# EAGLE design 502_outin_raspberrypi (EAGLE 9.6.2)
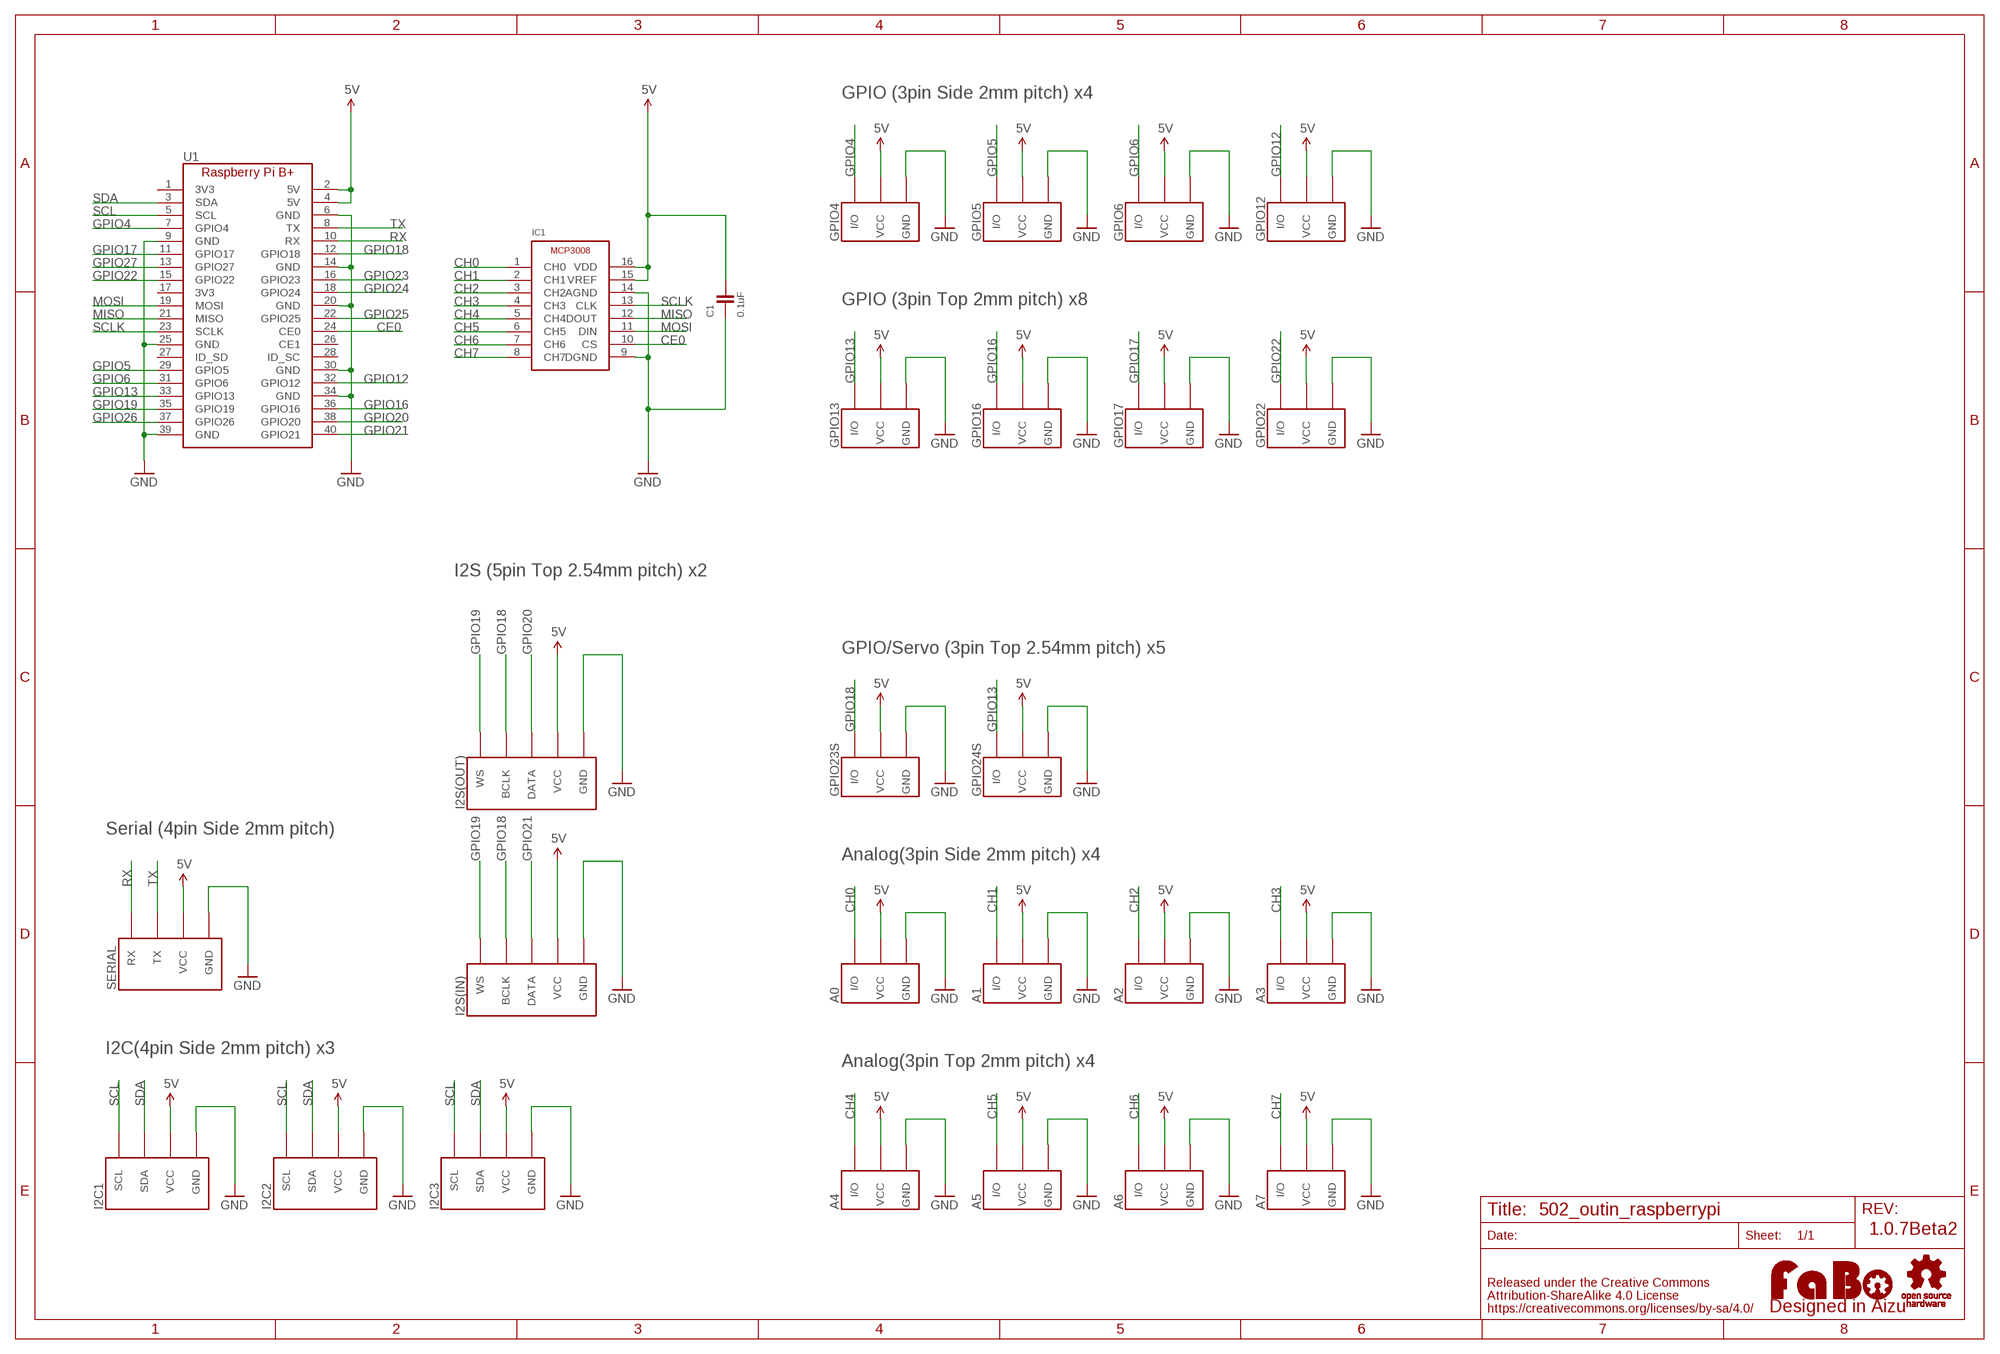
[diagram p0: schematic, sheet 1]

## Parts
A0  FABO_BRICK_3PIN-S03B-PASK-2  [FABO_BRICK_3PIN_S03B-PASK-2]
A1  FABO_BRICK_3PIN-S03B-PASK-2  [FABO_BRICK_3PIN_S03B-PASK-2]
A2  FABO_BRICK_3PIN-S03B-PASK-2  [FABO_BRICK_3PIN_S03B-PASK-2]
A3  FABO_BRICK_3PIN-S03B-PASK-2  [FABO_BRICK_3PIN_S03B-PASK-2]
A4  FABO_BRICK_3PIN-B03B-PASK-1  [FABO_BRICK_3PIN_B03B-PASK-1]
A5  FABO_BRICK_3PIN-B03B-PASK-1  [FABO_BRICK_3PIN_B03B-PASK-1]
A6  FABO_BRICK_3PIN-B03B-PASK-1  [FABO_BRICK_3PIN_B03B-PASK-1]
A7  FABO_BRICK_3PIN-B03B-PASK-1  [FABO_BRICK_3PIN_B03B-PASK-1]
C1  0.1uF  CAPACITOR-0603  [0603]
GPIO4  FABO_BRICK_3PIN-S03B-PASK-2  [FABO_BRICK_3PIN_S03B-PASK-2]
GPIO5  FABO_BRICK_3PIN-S03B-PASK-2  [FABO_BRICK_3PIN_S03B-PASK-2]
GPIO6  FABO_BRICK_3PIN-S03B-PASK-2  [FABO_BRICK_3PIN_S03B-PASK-2]
GPIO12  FABO_BRICK_3PIN-S03B-PASK-2  [FABO_BRICK_3PIN_S03B-PASK-2]
GPIO13  FABO_BRICK_3PIN-B03B-PASK-1  [FABO_BRICK_3PIN_B03B-PASK-1]
GPIO16  FABO_BRICK_3PIN-B03B-PASK-1  [FABO_BRICK_3PIN_B03B-PASK-1]
GPIO17  FABO_BRICK_3PIN-B03B-PASK-1  [FABO_BRICK_3PIN_B03B-PASK-1]
GPIO22  FABO_BRICK_3PIN-B03B-PASK-1  [FABO_BRICK_3PIN_B03B-PASK-1]
GPIO23S  FABO_BRICK_3PIN-HEADER  [FABO_BRICK_3PIN_HEADER]
GPIO24S  FABO_BRICK_3PIN-HEADER  [FABO_BRICK_3PIN_HEADER]
I2C1  FABO_BRICK_I2C-S04B-PASK-2  [FABO_BRICK_I2C_S04B-PASK-2]
I2C2  FABO_BRICK_I2C-S04B-PASK-2  [FABO_BRICK_I2C_S04B-PASK-2]
I2C3  FABO_BRICK_I2C-S04B-PASK-2  [FABO_BRICK_I2C_S04B-PASK-2]
I2S(IN)  FABO_BRICK_I2SLONG  [FABO_BRICK_I2S_S05B-PASK-2_LONG]
I2S(OUT)  FABO_BRICK_I2SLONG  [FABO_BRICK_I2S_S05B-PASK-2_LONG]
IC1  MICROCHIP-MCP3008  [MICROCHIP-MCP3008]
LOGO1  LOGO_FABO-M  [LOGO_FABO_M]
SERIAL  FABO_BRICK_SERIAL-S04B-PASK-2  [FABO_BRICK_SERIAL_S04B-PASK-2]
U1  RASPBERRY_PI_B+  [RASPBERRY_PI_B+]
U$4  LOGO_OSHW-T_M_BOTTOM  [LOGO_OSHW_T_MS_BOTTOM]

## Nets
5V: A0.VCC A1.VCC A2.VCC A3.VCC A4.VCC A5.VCC A6.VCC A7.VCC C1.2 GPIO4.VCC GPIO5.VCC GPIO6.VCC GPIO12.VCC GPIO13.VCC GPIO16.VCC GPIO17.VCC GPIO22.VCC GPIO23S.VCC GPIO24S.VCC I2C1.VCC I2C2.VCC I2C3.VCC I2S(IN).VCC I2S(OUT).VCC IC1.15(VREF) IC1.16(VDD) SERIAL.VCC U1.2(5V) U1.4(5V)
CE0: IC1.10(CS) U1.24(CE0)
CH0: A0.I/O IC1.1(CH0)
CH1: A1.I/O IC1.2(CH1)
CH2: A2.I/O IC1.3(CH2)
CH3: A3.I/O IC1.4(CH3)
CH4: A4.I/O IC1.5(CH4)
CH5: A5.I/O IC1.6(CH5)
CH6: A6.I/O IC1.7(CH6)
CH7: A7.I/O IC1.8(CH7)
GND: A0.GND A1.GND A2.GND A3.GND A4.GND A5.GND A6.GND A7.GND C1.1 GPIO4.GND GPIO5.GND GPIO6.GND GPIO12.GND GPIO13.GND GPIO16.GND GPIO17.GND GPIO22.GND GPIO23S.GND GPIO24S.GND I2C1.GND I2C2.GND I2C3.GND I2S(IN).GND I2S(OUT).GND IC1.9(DGND) IC1.14(AGND) SERIAL.GND U1.6(GND) U1.9(GND) U1.14(GND) U1.20(GND) U1.25(GND) U1.30(GND) U1.34(GND) U1.39(GND)
GPIO4: GPIO4.I/O U1.7(GPIO4)
GPIO5: GPIO5.I/O U1.29(GPIO5)
GPIO6: GPIO6.I/O U1.31(GPIO6)
GPIO12: GPIO12.I/O U1.32(GPIO12)
GPIO13: GPIO13.I/O GPIO24S.I/O U1.33(GPIO13)
GPIO16: GPIO16.I/O U1.36(GPIO16)
GPIO17: GPIO17.I/O U1.11(GPIO17)
GPIO18: GPIO23S.I/O I2S(IN).BCLK I2S(OUT).BCLK U1.12(GPIO18)
GPIO19: I2S(IN).WS I2S(OUT).WS U1.35(GPIO19)
GPIO20: I2S(OUT).DATA U1.38(GPIO20)
GPIO21: I2S(IN).DATA U1.40(GPIO21)
GPIO22: GPIO22.I/O U1.15(GPIO22)
GPIO23: U1.16(GPIO23)
GPIO24: U1.18(GPIO24)
GPIO25: U1.22(GPIO25)
GPIO26: U1.37(GPIO26)
GPIO27: U1.13(GPIO27)
MISO: IC1.12(DOUT) U1.21(MISO)
MOSI: IC1.11(DIN) U1.19(MOSI)
RX: SERIAL.RX U1.10(RX)
SCL: I2C1.SCL I2C2.SCL I2C3.SCL U1.5(SCL)
SCLK: IC1.13(CLK) U1.23(SCLK)
SDA: I2C1.SDA I2C2.SDA I2C3.SDA U1.3(SDA)
TX: SERIAL.TX U1.8(TX)
Unconnected: U1.1(3V3) U1.17(3V3) U1.26(CE1) U1.27(ID_SD) U1.28(ID_SC)

## Notes on the sheet
- GPIO (3pin Side 2mm pitch) x4
- GPIO (3pin Top 2mm pitch) x8
- I2S (5pin Top 2.54mm pitch) x2
- GPIO/Servo (3pin Top 2.54mm pitch) x5
- Serial (4pin Side 2mm pitch)
- Analog(3pin Side 2mm pitch) x4
- I2C(4pin Side 2mm pitch) x3
- Analog(3pin Top 2mm pitch) x4
- 1.0.7Beta2

## Library data of the parts
A0 A1-A7 GPIO4-GPIO6 GPIO12 GPIO13 GPIO16 GPIO17 GPIO22 GPIO23S GPIO24S = FaBo-Template:FABO_BRICK_3PIN: FaBo Brick 3pin
C1 = FaBo-Capacitor:CAPACITOR: CAPACITOR
I2C1-I2C3 = FaBo-Template:FABO_BRICK_I2C: FaBo Brick I2C
I2S(IN) I2S(OUT) = FaBo-Template:FABO_BRICK_I2S
IC1 = FaBo-ADC:MICROCHIP-MCP3008
LOGO1 = component:LOGO_FABO
SERIAL = FaBo-Template:FABO_BRICK_SERIAL: FaBo Brick Serial
U1 = FaBo-Boards:RASPBERRY_PI_B+
U$4 = FaBo-etc:LOGO_OSHW

## Board
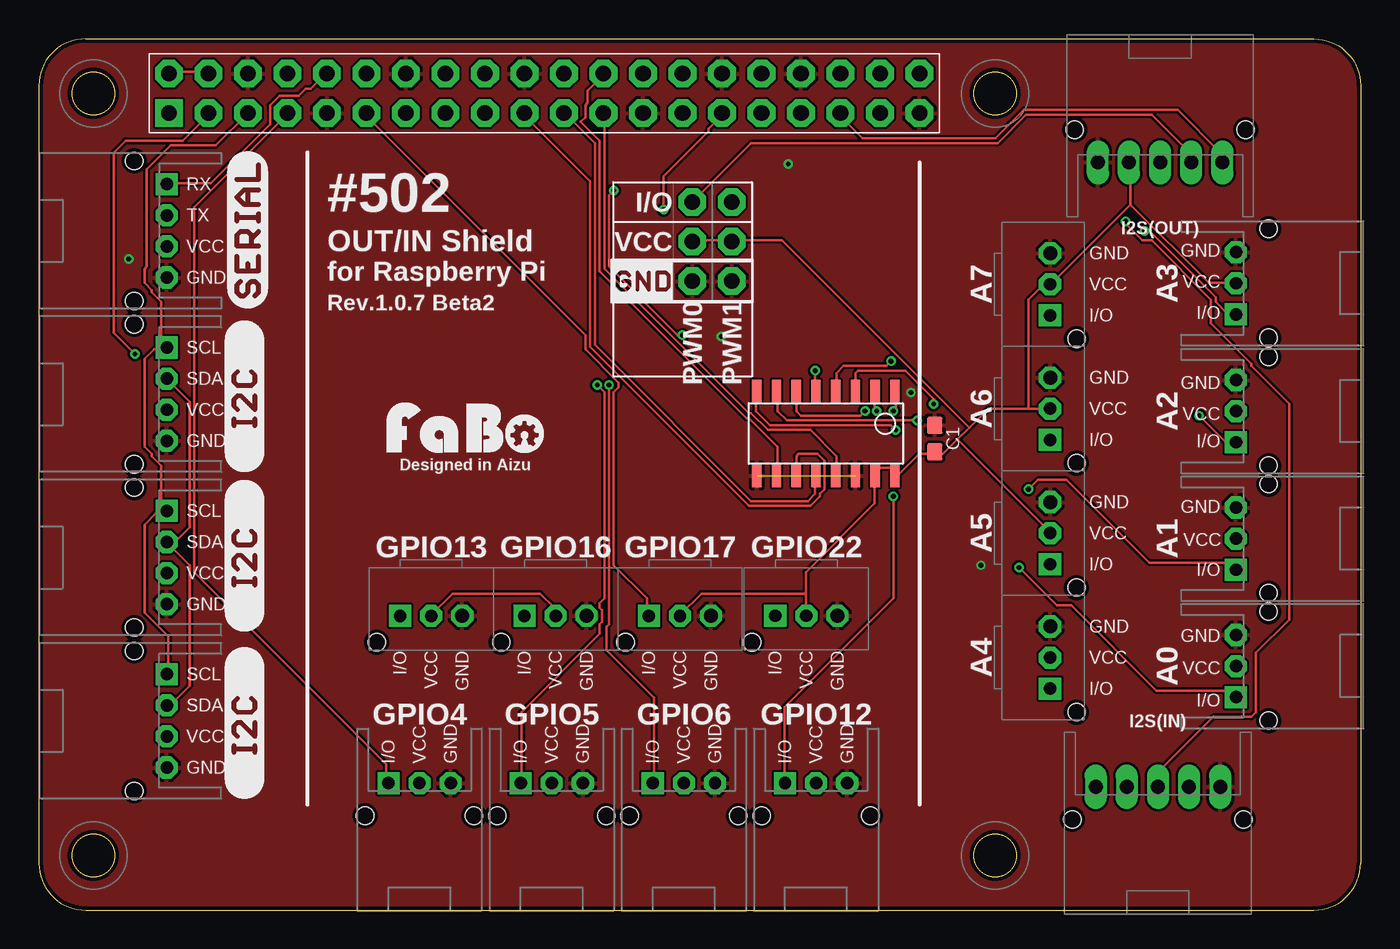
[diagram p1: board, top side]
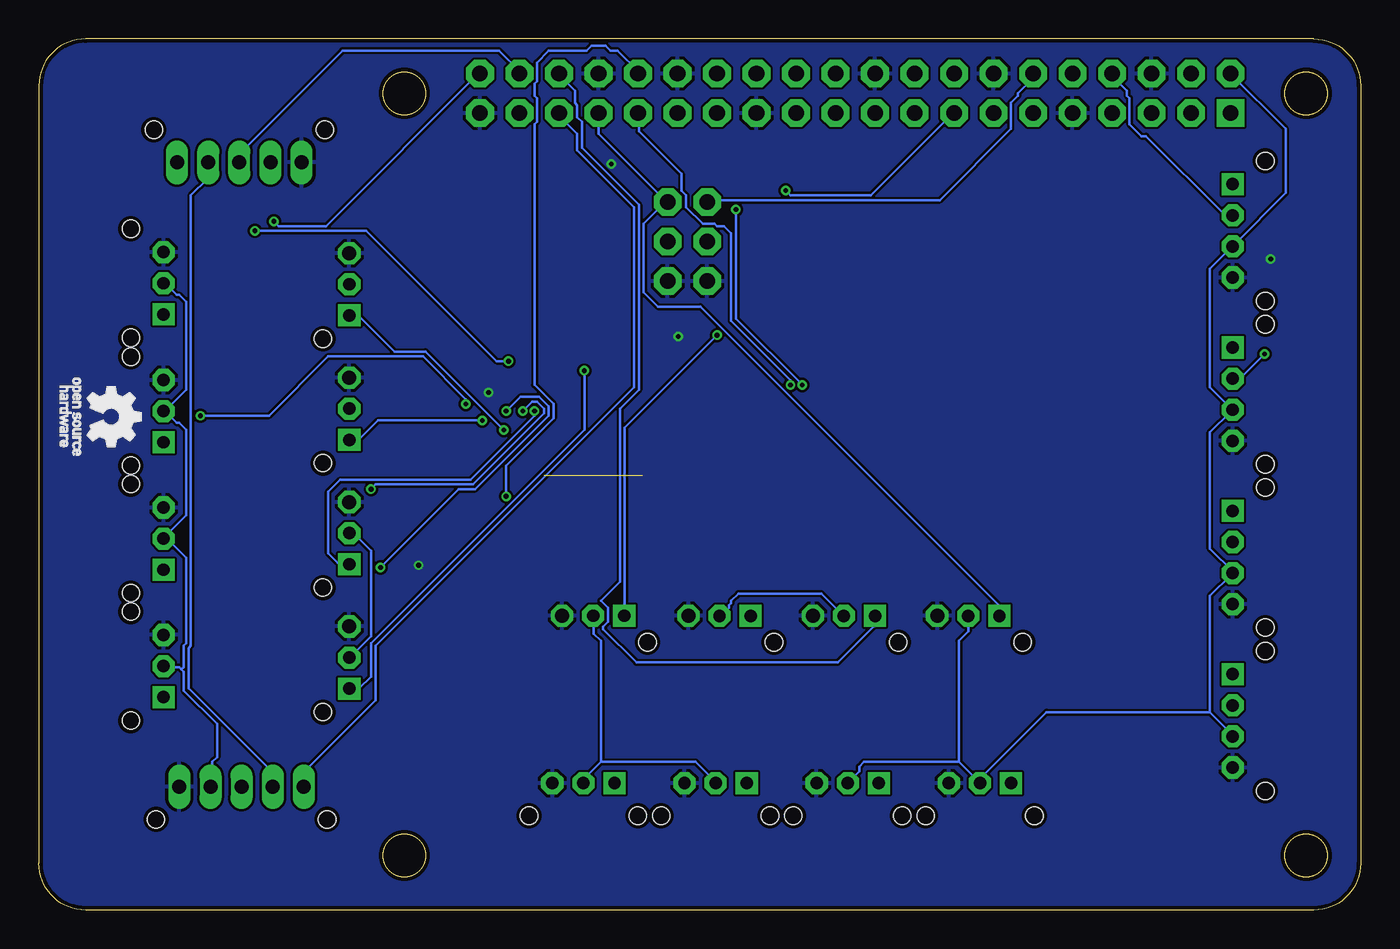
[diagram p2: board, bottom side, seen from below]

Size 85 x 56 mm. Coordinates in mm from the lower left corner, seen from the top.
Copper layers (1*16): Top 0.035mm / dielectric 1.6mm / Bottom 0.035mm
Design rules "PCBway": minimum track width 6mil, minimum drill 12mil, track to track 6mil, track to pad 6mil, pad to pad 6mil, via to via 6mil, smd to smd 6mil, copper to edge 10mil, drill to drill 10mil, minimum pad ring 10mil, minimum via ring 6mil, stop-mask expansion 2mil, vias tented up to drill 100mil, thermal gap 8mil

### Footprints (pad centres in the part's own frame; a part is rotated, then mirrored left to right if it is on the bottom)
FABO_BRICK_3PIN_S03B-PASK-2 = drill 0.8 pad 1.422 octagon: GND -2,0; VCC 0,0 | drill 0.8 pad 1.422 square: I/O 2,0 | hole 1.1: 3.5,2.1; -3.5,2.1
FABO_BRICK_3PIN_B03B-PASK-1 = drill 0.9 pad 1.422 octagon: GND -2,0 | drill 0.8 pad 1.422 square: I/O 2,0 | drill 0.8 pad 1.422 octagon: VCC 0,0 | hole 1.1: 3.5,1.7
0603 = smd 1.1 x 1: 1 -0.85,0; 2 0.85,0
FABO_BRICK_3PIN_HEADER = drill 1 pad 1.778 octagon: GND -2.54,0; I/O 2.54,0; VCC 0,0
FABO_BRICK_I2C_S04B-PASK-2 = drill 0.8 pad 1.422 octagon: GND -3,0; SDA 1,0; VCC -1,0 | drill 0.8 pad 1.422 square: SCL 3,0 | hole 1.1: 4.5,2.1; -4.5,2.1
FABO_BRICK_I2S_S05B-PASK-2_LONG = drill 0.9 pad 1.422 long: BCLK 3,0; DATA 1,0; GND -3,0; VCC -1,0; WS 5,0 | hole 1.1: 6.5,2.1; -4.5,2.1
MICROCHIP-MCP3008 = smd 0.6 x 1.5: 1 -4.445,-2.7; 2 -3.175,-2.7; 3 -1.905,-2.7; 4 -0.635,-2.7; 5 0.635,-2.7; 6 1.905,-2.7; 7 3.175,-2.7; 8 4.445,-2.7; 9 4.445,2.7; 10 3.175,2.7; 11 1.905,2.7; 12 0.635,2.7; 13 -0.635,2.7; 14 -1.905,2.7; 15 -3.175,2.7; 16 -4.445,2.7
FABO_BRICK_SERIAL_S04B-PASK-2 = drill 0.8 pad 1.422 octagon: GND -3,0; TX 1,0; VCC -1,0 | drill 0.8 pad 1.422 square: RX 3,0 | hole 1.1: 4.5,2.1; -4.5,2.1
RASPBERRY_PI_B+ = drill 1 pad 1.778 square: 1 0,-2.54 | drill 1 pad 1.778 octagon: 2 0,0; 3 2.54,-2.54; 4 2.54,0; 5 5.08,-2.54; 6 5.08,0; 7 7.62,-2.54; 8 7.62,0; 9 10.16,-2.54; 10 10.16,0; 11 12.7,-2.54; 12 12.7,0; 13 15.24,-2.54; 14 15.24,0; 15 17.78,-2.54; 16 17.78,0; 17 20.32,-2.54; 18 20.32,0; 19 22.86,-2.54; 20 22.86,0; 21 25.4,-2.54; 22 25.4,0; 23 27.94,-2.54; 24 27.94,0; 25 30.48,-2.54; 26 30.48,0; 27 33.02,-2.54; 28 33.02,0; 29 35.56,-2.54; 30 35.56,0; 31 38.1,-2.54; 32 38.1,0; 33 40.64,-2.54; 34 40.64,0; 35 43.18,-2.54; 36 43.18,0; 37 45.72,-2.54; 38 45.72,0; 39 48.26,-2.54; 40 48.26,0

### Placement (x,y rotation side)
A0  76.98,15.68 270 top
A1  76.98,23.88 270 top
A2  76.98,32.07 270 top
A3  76.98,40.29 270 top
A4  65.03,16.23 270 top
A5  65.03,24.23 270 top
A6  65.03,32.23 270 top
A7  65.03,40.23 270 top
C1  57.62,30.3 270 top
GPIO4  24.48,8.16 180 top
GPIO5  32.98,8.16 180 top
GPIO6  41.48,8.16 180 top
GPIO12  49.98,8.16 180 top
GPIO13  25.23,18.91 180 top
GPIO16  33.23,18.91 180 top
GPIO17  41.23,18.91 180 top
GPIO22  49.36,18.92 180 top
GPIO23S  42.02,42.98 90 top
GPIO24S  44.56,42.98 90 top
I2C1  8.23,33.16 90 top
I2C2  8.23,22.66 90 top
I2C3  8.23,12.16 90 top
I2S(IN)  72.96,7.92 180 top
I2S(OUT)  71.11,48.06 0 top
IC1  50.61,30.63 180 top
LOGO1  27.42,29.01 0 top
SERIAL  8.23,43.66 90 top
U1  8.37,53.77 0 top
U$2  [LOGO_SILK_I2C]  14.48,17.91 90 top
U$3  [LOGO_SILK_SERIAL2]  14.73,38.66 90 top
U$4  80.38,31.7 90 top
U$5  [LOGO_SILK_I2C]  14.48,7.16 90 top
U$6  [LOGO_SILK_I2C]  14.48,28.16 90 top
U$7  [LOGO_SILK_GND]  36.95,39.17 0 top

### Tracks (layer width: path | path; a pad name or v marks a point on that pad's centre or on a via)
5V
  Top 0.152: 70.19,45.34 65.16,40.31 A7.VCC 65.01,40.16 64.56,40.16 63.64,39.24 63.64,32.23 | 70.19,45.34 70.19,47.93 I2S(OUT).VCC | 70.19,45.34 75.22,40.31 76.9,40.31 A3.VCC | U1.2 8.47,53.87 10.91,53.87 U1.4 | GPIO13.VCC 25.24,18.97 26.61,20.34 32.25,20.34 33.16,19.43 33.16,18.97 GPIO16.VCC | GPIO23S.VCC 42.15,43.05 44.44,43.05 GPIO24S.VCC 44.59,43.05 47.79,43.05 59.83,31.01 | 55.11,28.12 55.26,27.96 56.63,29.34 57.54,29.34 C1.2 57.7,29.34 57.7,29.03 57.85,29.03 59.07,30.25 | 55.11,28.12 54.95,27.96 IC1.16 55.11,28.12 | 55.11,28.12 55.11,28.42 53.73,28.42 53.73,27.96 IC1.15 53.73,27.81 53.73,26.14 49.31,21.72 49.31,20.34 | 49.31,20.34 49.31,18.97 GPIO22.VCC | 63.64,32.23 61.05,32.23 59.83,31.01 | 63.64,32.23 65.01,32.23 A6.VCC | 59.07,30.25 59.83,31.01 | 59.07,30.25 65.01,24.31 A5.VCC | 49.31,20.34 42.61,20.34 41.24,18.97 GPIO17.VCC
  Bottom 0.152: 75.83,15.47 75.98,15.62 76.9,15.62 A0.VCC | 75.83,15.47 75.68,15.31 75.68,14.1 73.55,11.96 73.55,9.83 73.85,9.52 73.85,8 I2S(IN).VCC | 75.83,15.47 75.68,15.62 75.68,16.99 75.53,17.14 75.53,22.63 76.44,23.54 76.59,23.54 76.9,23.85 A1.VCC 76.9,24 75.53,25.37 75.53,30.86 75.98,31.32 76.14,31.32 76.9,32.08 | 76.9,32.08 75.53,33.45 75.53,39.09 75.98,39.55 76.14,39.55 76.9,40.31 A3.VCC | 76.9,32.08 A2.VCC | 9.69,12.72 8.62,11.66 8.62,11.5 8.32,11.2 I2C3.VCC | 9.69,12.72 9.69,20.19 8.32,21.56 I2C2.VCC 8.17,21.72 9.69,23.24 9.69,30.71 8.32,32.08 I2C1.VCC 8.32,32.23 9.69,33.6 9.69,41.22 8.32,42.59 SERIAL.VCC 8.17,42.75 4.81,46.1 4.81,50.21 U1.2 | 25.84,9.52 24.63,8.3 | 25.84,9.52 31.94,9.52 32.25,9.22 32.25,8.91 32.86,8.3 GPIO5.VCC | GPIO17.VCC 41.08,18.97 40.63,19.43 40.63,19.58 40.48,19.73 40.48,19.89 40.02,20.34 34.68,20.34 33.31,18.97 GPIO16.VCC | 25.84,9.52 25.84,17.3 25.24,17.91 25.24,18.82 GPIO13.VCC | 48.86,9.52 42.76,9.52 41.54,8.3 GPIO6.VCC | 48.86,9.52 50.08,8.3 GPIO12.VCC | A4.VCC 65.01,16.23 63.64,17.6 63.64,23.09 64.71,24.15 65.01,24.15 A5.VCC | 48.86,9.52 48.86,17.3 49.31,17.75 49.31,18.82 GPIO22.VCC | 9.69,12.72 20.21,12.72 24.63,8.3 | 24.63,8.3 GPIO4.VCC
CE0
  Top 0.152: IC1.10 47.49,27.96 47.49,29.79 45.66,31.62 45.5,31.62 36.06,41.07 36.06,49.45 34.84,50.67 35.14,50.98 35.14,51.74 35.29,51.89 35.29,52.65 36.36,53.72 U1.24
CH0  (via drill 0.3)
  Top 0.152: v54.95,32.08 55.11,32.23 55.11,33.3 IC1.1 | v63.03,22.02 65.47,19.58 66.38,19.58 71.87,14.1 76.59,14.1 76.9,13.79 A0.I/O
  Bottom 0.152: v54.95,32.08 54.04,32.99 52.82,32.99 52.21,32.38 52.21,31.77 56.93,27.05 58,27.05 v63.03,22.02
CH1  (via drill 0.3)
  Top 0.152: v53.89,32.08 53.73,32.23 53.73,33.3 IC1.2 | v63.64,27.05 64.25,27.66 66.08,27.66 71.41,22.33 76.59,22.33 76.9,22.02 A1.I/O
  Bottom 0.152: v53.89,32.08 53.28,32.69 52.97,32.69 52.51,32.23 52.51,31.93 57.09,27.35 63.34,27.35 v63.64,27.05
CH2  (via drill 0.3)
  Top 0.152: IC1.3 52.51,34.52 52.67,34.67 55.72,34.67 57.54,32.84 v57.54,32.54 | v74.61,31.77 76.29,30.1 76.9,30.1 A2.I/O
  Bottom 0.152: v57.54,32.54 57.54,32.84 60.29,35.58 66.38,35.58 70.19,31.77 v74.61,31.77
CH3  (via drill 0.3)
  Top 0.152: v54.8,35.28 54.5,34.97 51.75,34.97 51.3,34.52 51.3,33.45 IC1.4 | v71.11,43.66 71.41,43.66 75.68,39.39 75.68,39.09 76.44,38.33 76.9,38.33 A3.I/O
  Bottom 0.152: v54.8,35.28 55.56,35.28 63.95,43.66 v71.11,43.66
CH4  (via drill 0.3)
  Top 0.152: v49.92,34.67 49.92,33.45 IC1.5
  Bottom 0.152: v49.92,34.67 49.92,30.86 63.64,17.14 63.64,15.01 64.4,14.25 65.01,14.25 A4.I/O
CH5  (via drill 0.3)
  Top 0.152: IC1.6 48.7,32.08 49.01,31.77 52.82,31.77 v53.12,32.08
  Bottom 0.152: v53.12,32.08 53.12,31.77 57.24,27.66 65.62,27.66 66.38,26.9 66.38,22.93 65.77,22.33 65.16,22.33 A5.I/O
CH6  (via drill 0.3)
  Top 0.152: v56.48,31.47 48.1,31.47 47.49,32.08 47.49,33.3 IC1.7
  Bottom 0.152: v56.48,31.47 63.18,31.47 64.4,30.25 65.01,30.25 A6.I/O
CH7  (via drill 0.3)
  Top 0.152: v55.11,30.86 54.8,31.16 47.03,31.16 46.11,32.08 46.11,33.3 IC1.8
  Bottom 0.152: v55.11,30.86 60.13,35.89 62.12,35.89 64.4,38.17 65.01,38.17 A7.I/O
GND  (via drill 0.3)  (1 unrouted)
  other vias: 5.78,41.86 60.58,22.16 43.88,36.86 56.08,33.26 48.18,47.96
  pour Bottom: -0.52,-0.84 85.48,-0.84 85.48,56.16 -0.52,56.16
  pour Top: -0.52,-0.84 85.48,-0.84 85.48,56.16 -0.52,56.16
GPIO4
  Top 0.152: GPIO4.I/O 22.34,8.3 22.34,9.37 10,21.72 10,45.19 15.94,51.13 U1.7
GPIO5  (via drill 0.3)
  Top 0.152: v35.9,33.76 36.36,33.3 36.36,20.04 36.06,19.73 36.06,19.43 36.21,19.28 36.21,18.52 36.06,18.36 36.06,17.75 31.03,12.72 31.03,8.3 GPIO5.I/O | v40.17,45.03 40.17,47.17 43.07,50.06 43.07,50.21 43.98,51.13 U1.29
  Bottom 0.152: v35.9,33.76 40.17,38.02 v40.17,45.03
GPIO6  (via drill 0.3)
  Top 0.152: v36.67,33.76 36.67,18.36 36.51,18.21 36.51,16.69 39.56,13.64 39.56,8.3 GPIO6.I/O
  Bottom 0.152: v36.67,33.76 36.67,34.06 40.48,37.87 40.48,43.51 40.93,43.97 41.39,43.97 41.54,44.12 42.3,44.12 43.37,45.19 43.37,45.95 43.68,46.25 43.68,47.32 46.42,50.06 46.42,51.13 U1.31
GPIO12  (via drill 0.3)
  Top 0.152: v54.95,26.59 54.95,20.04 47.94,13.03 47.94,8.3 GPIO12.I/O
  Bottom 0.152: v54.95,26.59 54.95,28.57 51.91,31.62 51.91,32.54 53.12,33.76 53.12,50.52 52.97,50.67 52.97,52.2 53.12,52.35 53.12,53.11 52.97,53.26 52.97,54.48 52.21,55.24 49.77,55.24 49.47,55.55 48.55,55.55 48.25,55.24 47.79,55.24 46.42,53.87 U1.32
GPIO13
  Bottom 0.152: GPIO13.I/O 23.25,18.97 23.25,19.58 42.46,38.78 45.2,38.78 46.11,39.7 46.11,44.12 44.59,45.64 GPIO24S.I/O 44.59,45.49 49.01,49.91 U1.33
GPIO16
  Bottom 0.152: GPIO16.I/O 31.33,18.82 31.33,18.21 33.62,15.92 46.57,15.92 48.7,18.06 48.7,18.21 48.4,18.52 48.4,19.43 48.86,19.89 47.64,21.11 47.64,32.23 46.42,33.45 46.42,45.34 50.08,49 50.08,50.67 50.38,50.98 50.38,51.74 50.53,51.89 50.53,52.65 51.6,53.72 U1.36
GPIO17
  Top 0.152: GPIO17.I/O 39.1,18.97 39.1,20.04 36.97,22.17 36.97,33.3 37.27,33.6 37.27,33.91 35.14,36.04 35.14,36.96 20.97,51.13 U1.11
GPIO18
  Top 0.152: GPIO23S.I/O 45.81,49.3 61.66,49.3 63.49,51.13 71.56,51.13 74,48.69 74,48.08 I2S(OUT).BCLK
  Bottom 0.152: U1.12 21.12,53.72 21.12,53.41 22.03,52.5 22.03,52.35 22.49,51.89 22.49,50.21 27.06,45.64 42,45.64 GPIO23S.I/O | I2S(IN).BCLK 70.04,8 70.04,8.91 75.38,14.25 75.38,16.84 75.22,16.99 75.22,45.95 74.16,47.01 74.16,47.93 I2S(OUT).BCLK
GPIO19
  Top 0.152: I2S(OUT).WS 75.98,48.08 75.98,48.69 73.24,51.43 63.34,51.43 61.51,49.6 52.97,49.6 51.45,51.13 U1.35
  Bottom 0.152: I2S(IN).WS 67.91,8 67.91,8.91 63.34,13.49 63.34,16.99 46.72,33.6 46.72,45.19 50.38,48.84 50.38,49.91 51.6,51.13 U1.35
GPIO20
  Bottom 0.152: I2S(OUT).DATA 72.02,48.08 72.02,48.69 65.47,55.24 55.41,55.24 54.04,53.87 U1.38
GPIO21  (via drill 0.3)
  Top 0.152: v69.89,44.27 69.89,44.12 70.96,43.05 71.56,43.05 75.38,39.24 75.38,37.72 77.97,35.13 77.97,34.97 80.4,32.54 80.4,18.67 78.27,16.53 78.27,12.72 77.97,12.42 75.53,12.42 72.02,8.91 72.02,8 I2S(IN).DATA
  Bottom 0.152: v69.89,44.27 69.58,43.97 66.54,43.97 56.63,53.87 U1.40
GPIO22  (via drill 0.3)
  Top 0.152: v41.39,36.96 41.08,36.96 36.67,41.38 36.67,45.95 v36.97,46.25
  Bottom 0.152: v41.39,36.96 47.33,31.01 47.33,18.97 GPIO22.I/O | v36.97,46.25 36.67,45.95 31.48,45.95 26.15,51.28 U1.15
MISO
  Top 0.152: IC1.12 49.92,27.81 49.92,26.74 49.47,26.29 45.81,26.29 35.75,36.35 35.75,49.3 33.77,51.28 U1.21
MOSI
  Top 0.152: IC1.11 48.7,29.18 48.86,29.34 50.08,29.34 50.53,28.88 50.53,27.05 50.23,26.74 50.23,26.59 49.62,25.98 45.66,25.98 35.45,36.19 35.45,46.86 31.18,51.13 U1.19
RX
  Top 0.152: SERIAL.RX 8.32,46.71 11.06,46.71 14.87,50.52 14.87,51.74 15.48,52.35 16.7,52.35 17.16,52.81 17.46,52.81 18.53,53.87 U1.10
SCL
  Top 0.152: 7.86,25.53 8.17,25.53 I2C2.SCL 7.86,25.53 | 7.86,25.53 7.56,25.53 6.79,24.76 6.79,19.12 8.32,17.6 8.32,15.16 I2C3.SCL | 7.86,36.04 7.4,36.04 6.79,35.43 6.79,29.79 7.25,29.34 7.25,29.18 7.86,28.57 7.86,25.53 | 7.86,36.04 8.17,36.04 I2C1.SCL 7.86,36.04 | U1.5 11.37,49.15 8.47,49.15 6.95,47.62 6.95,41.38 6.79,41.22 6.79,40.31 7.25,39.85 7.25,39.7 7.86,39.09 7.86,36.04
SCLK
  Top 0.152: IC1.13 51.3,27.96 51.3,29.18 49.62,30.86 46.88,30.86 45.81,31.93 45.66,31.93 36.36,41.22 36.36,51.13 U1.23
SDA  (via drill 0.3)
  Top 0.152: 8.47,23.39 8.32,23.54 I2C2.SDA 8.47,23.39 | 8.47,23.39 9.69,22.17 9.69,14.4 8.78,13.49 8.62,13.49 8.32,13.18 I2C3.SDA | 8.47,23.39 9.69,24.61 9.69,32.69 8.32,34.06 I2C1.SDA | v6.19,35.74 4.81,37.11 4.81,48.69 5.58,49.45 9.23,49.45 10.91,51.13 U1.3
  Bottom 0.152: v6.19,35.74 7.71,34.21 8.17,34.21 I2C1.SDA
TX
  Bottom 0.152: SERIAL.TX 8.32,44.73 8.78,44.73 13.81,49.76 14.11,49.76 14.87,50.52 14.87,52.2 15.02,52.35 15.02,52.65 16.09,53.72 U1.8

### Text on the board
tPlace: RX | TX | #502 | I/O | VCC | VCC | OUT/IN Shield | GND | GND | GND | for Raspberry Pi | VCC | VCC | PWM0 | PWM1 | Rev.1.0.7 Beta2 | I/O | I/O | SCL | SDA | GND | GND | VCC | VCC | VCC | GND | I/O | I/O | Designed in Aizu | GND | GND | SCL | VCC | VCC | SDA | I/O | I/O | VCC | GND | GND | I/O | VCC | GND | I/O | VCC | GND | I/O | VCC | GND | I/O | VCC | GND | GND | VCC | SCL | VCC | I/O | SDA | I/O | VCC | GND | I/O | VCC | GND | I/O | VCC | GND | I/O | VCC | GND | I/O | VCC | GND